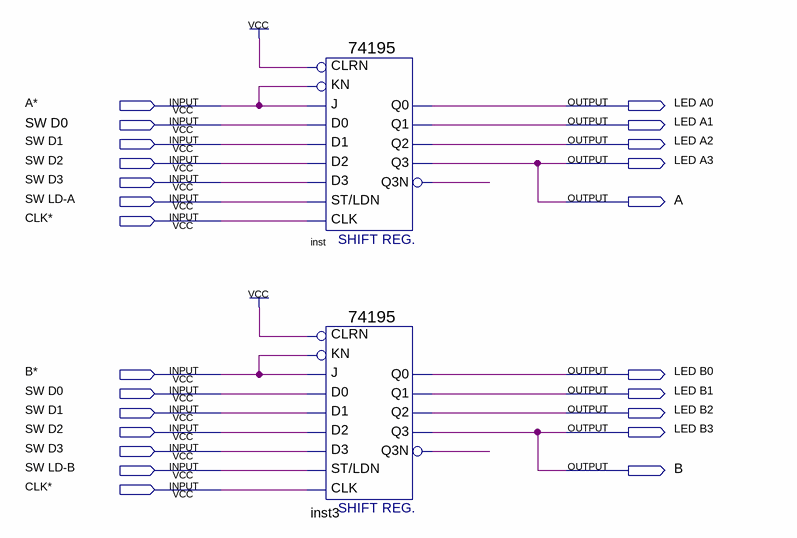
[diagram p0: schematic sheet]
// Quartus schematic Registers1.bdf as structural Verilog: 2 symbols, 24 pins
module Registers1 (
  input  \A* ,
  input  \SW_D0 ,
  input  \SW_D1 ,
  input  \SW_D2 ,
  input  \SW_D3 ,
  input  \SW_LD-A ,
  input  \CLK* ,
  input  \B* ,
  input  \SW_LD-B ,
  output \LED_A0 ,
  output \LED_A1 ,
  output \LED_A2 ,
  output \LED_A3 ,
  output A,
  output \LED_B0 ,
  output \LED_B1 ,
  output \LED_B2 ,
  output \LED_B3 ,
  output B
);

  wire inst3_q3n, inst_q3n;

  \74195  inst (
    .\ST/LDN (\SW_LD-A ), .KN(\A* ), .CLRN(1'b1), .D2(\SW_D2 ), .D1(\SW_D1 ), .D0(\SW_D0 ), .J(\A* ),
    .CLK(\CLK* ), .D3(\SW_D3 ), .Q3(A), .Q3N(inst_q3n), .Q0(\LED_A0 ), .Q1(\LED_A1 ), .Q2(\LED_A2 ));
  \74195  inst3 (
    .\ST/LDN (\SW_LD-B ), .KN(\B* ), .CLRN(1'b1), .D2(\SW_D2 ), .D1(\SW_D1 ), .D0(\SW_D0 ), .J(\B* ),
    .CLK(\CLK* ), .D3(\SW_D3 ), .Q3(B), .Q3N(inst3_q3n), .Q0(\LED_B0 ), .Q1(\LED_B1 ), .Q2(\LED_B2 ));

  assign \LED_A3  = A;
  assign \LED_B3  = B;
endmodule
